# Altium schematic sheet LaunchPad Connectors.SchDoc
size A2
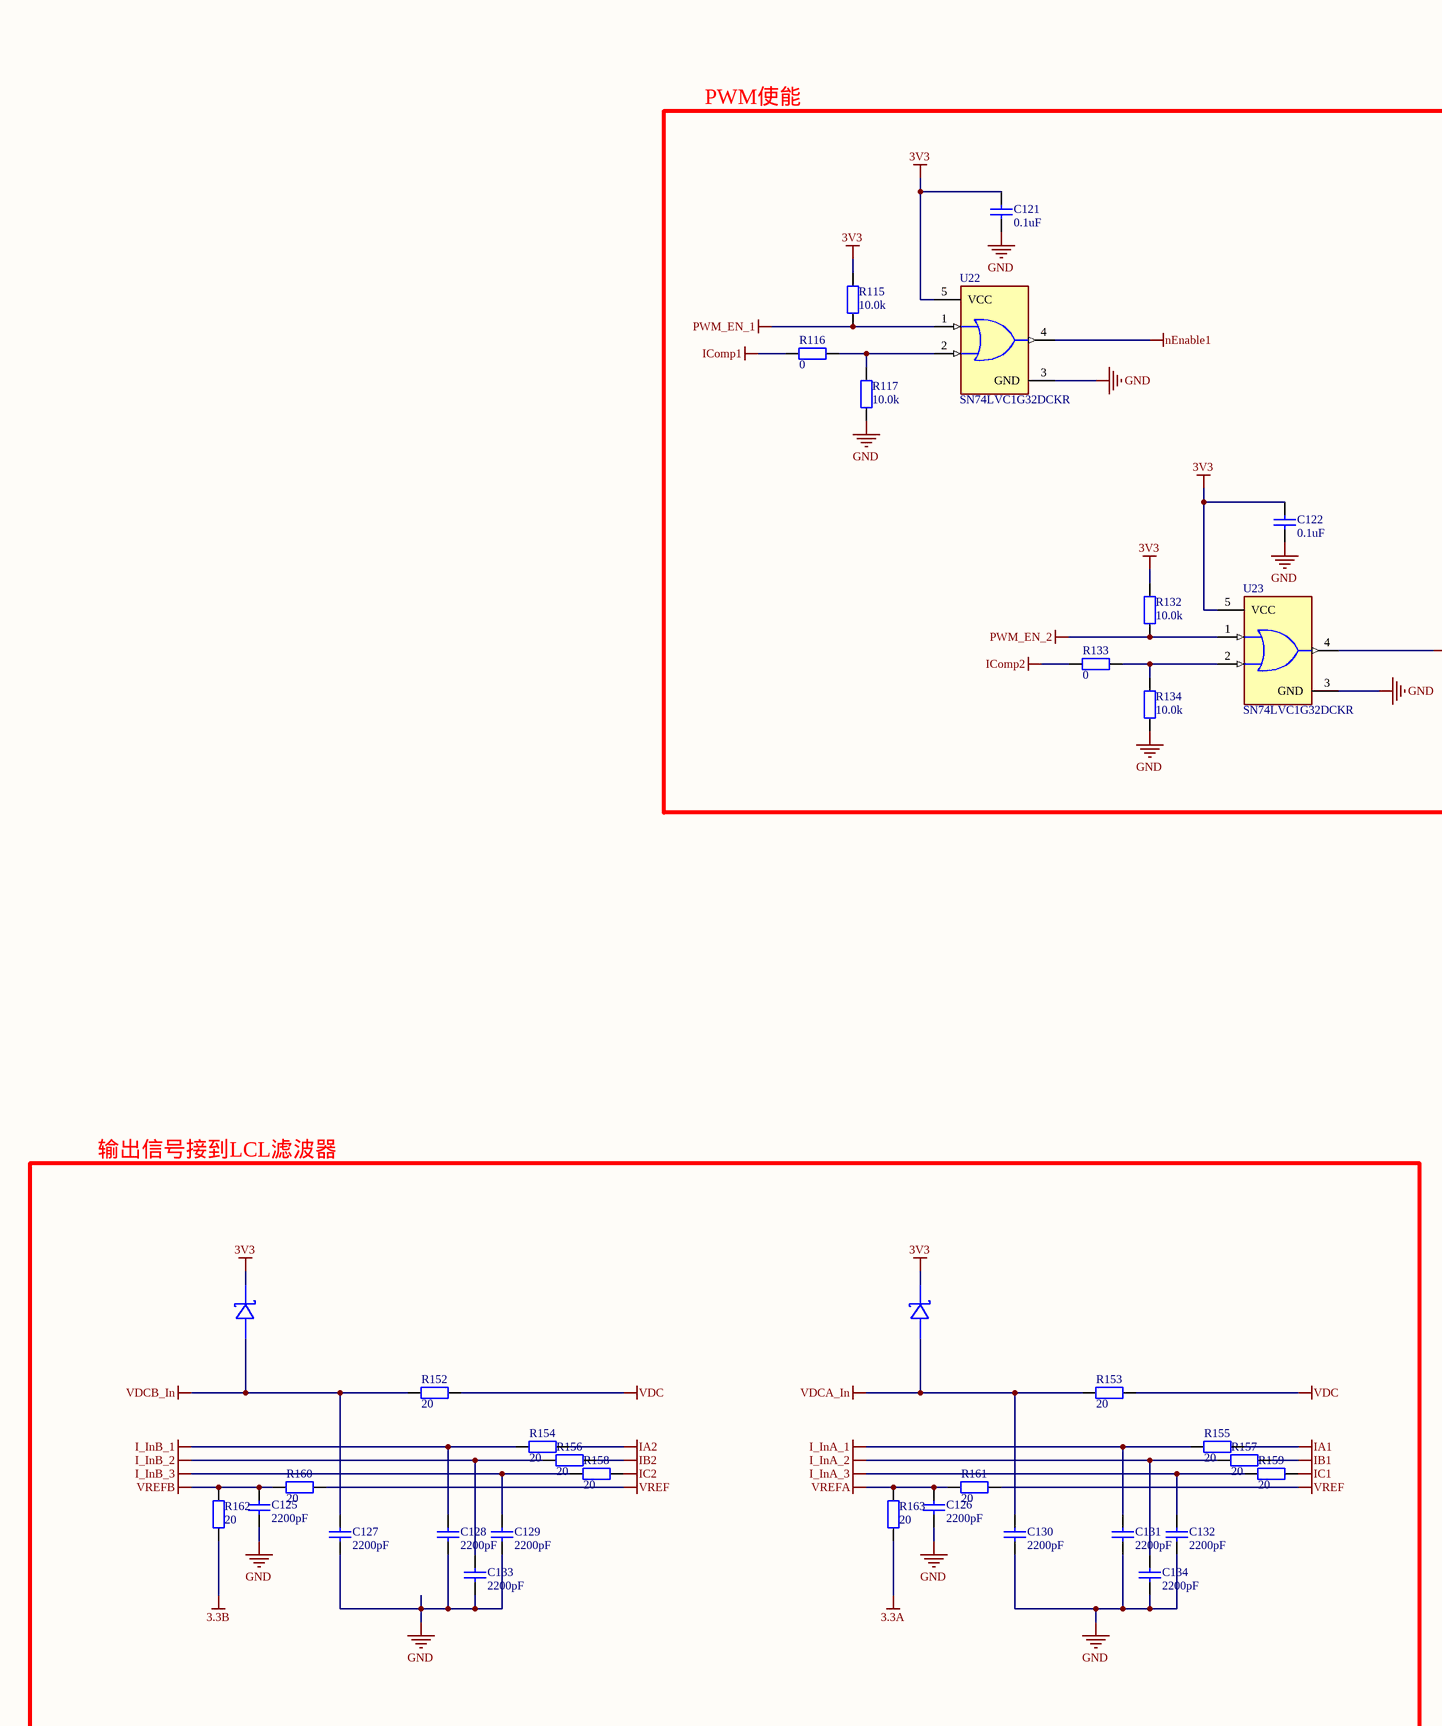
[diagram p0: LaunchPad Connectors.SchDoc, left]
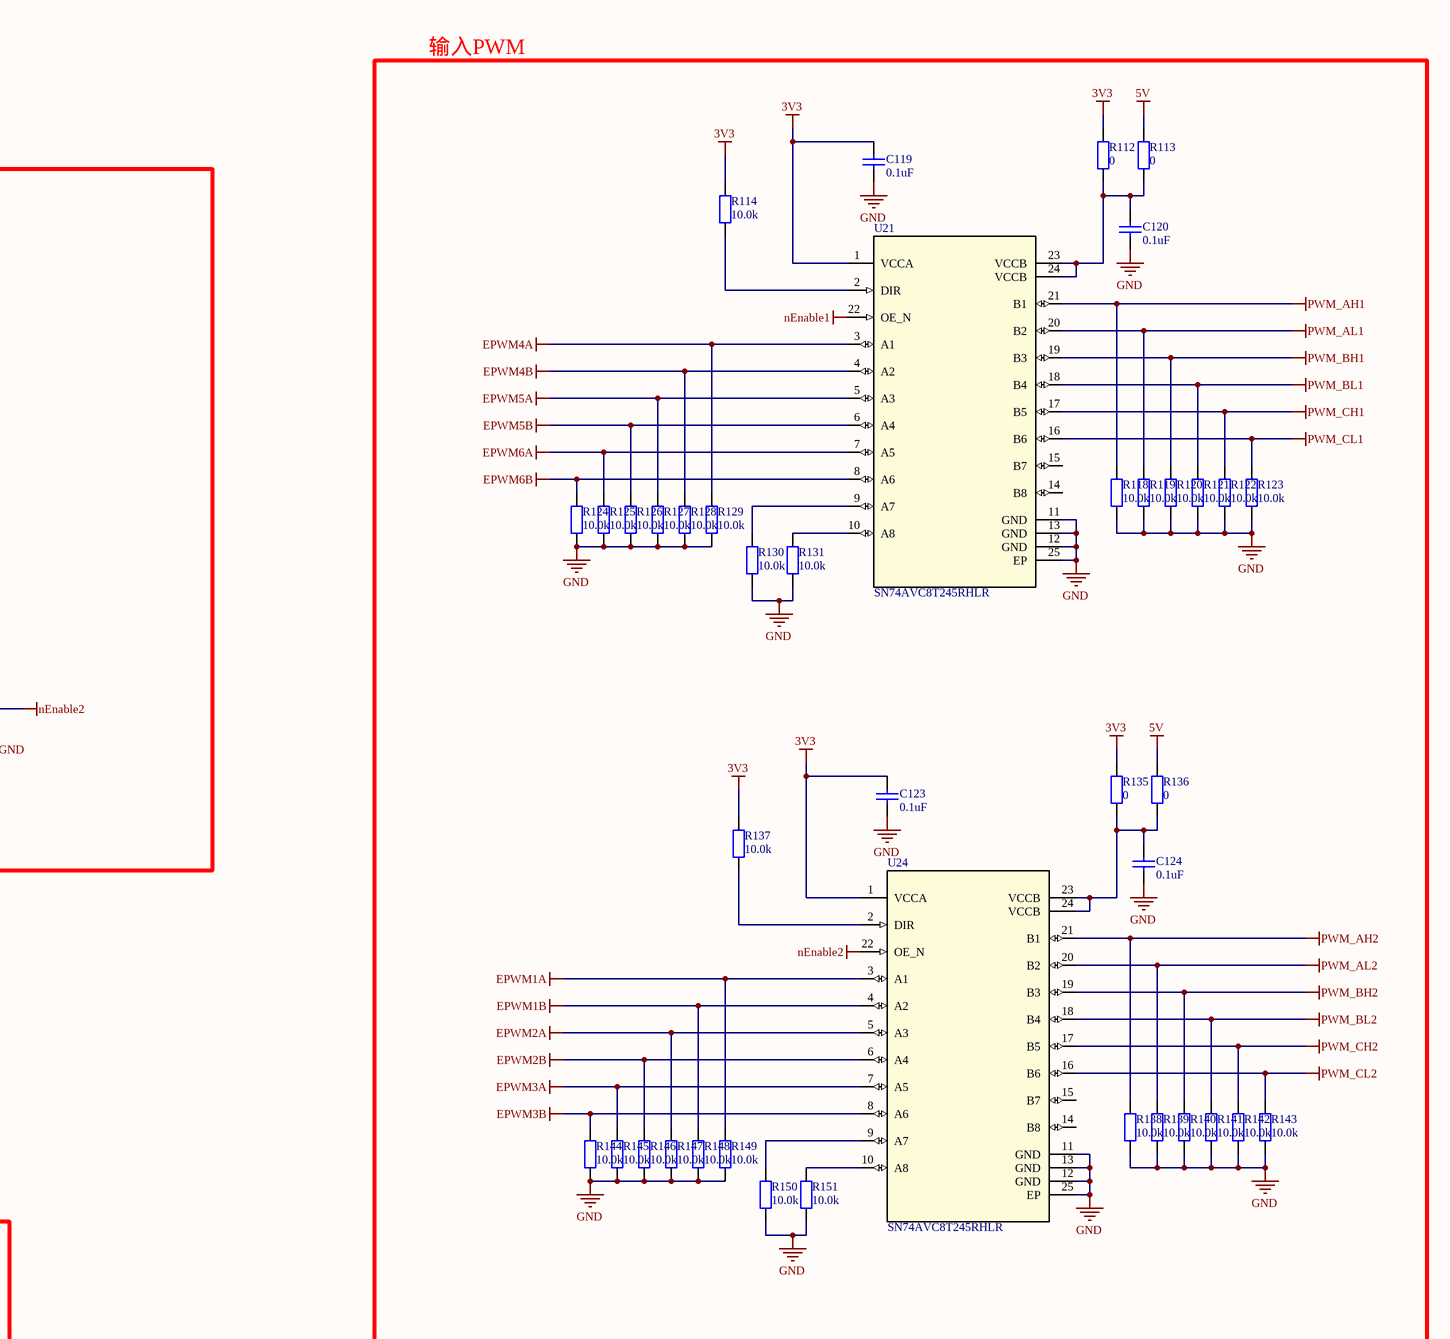
[diagram p1: LaunchPad Connectors.SchDoc, right]

## Parts
C119  0.1uF  [CAPC1608X06N]
C120  0.1uF  [CAPC1608X06N]
C121  0.1uF  [CAPC1608X06N]
C122  0.1uF  [CAPC1608X06N]
C123  0.1uF  [CAPC1608X06N]
C124  0.1uF  [CAPC1608X06N]
C125  2200pF  [CAPC1608X06N]
C126  2200pF  [CAPC1608X06N]
C127  2200pF  [CAPC1608X06N]
C128  2200pF  [CAPC1608X06N]
C129  2200pF  [CAPC1608X06N]
C130  2200pF  [CAPC1608X06N]
C131  2200pF  [CAPC1608X06N]
C132  2200pF  [CAPC1608X06N]
C133  2200pF  [CAPC1608X06N]
C134  2200pF  [CAPC1608X06N]
D1  1PS79SB70,115  [SOD-523_L1.2-W0.8-LS1.6-RD]  (value not drawn)
D2  1PS79SB70,115  [SOD-523_L1.2-W0.8-LS1.6-RD]  (value not drawn)
R112  0  [RESC1608X05N]
R113  0  [RESC1608X05N]
R114  10.0k  [RESC1608X05N]
R115  10.0k  [RESC1608X05N]
R116  0  [RESC1608X05N]
R117  10.0k  [RESC1608X05N]
R118  10.0k  [RESC1608X05N]
R119  10.0k  [RESC1608X05N]
R120  10.0k  [RESC1608X05N]
R121  10.0k  [RESC1608X05N]
R122  10.0k  [RESC1608X05N]
R123  10.0k  [RESC1608X05N]
R124  10.0k  [RESC1608X05N]
R125  10.0k  [RESC1608X05N]
R126  10.0k  [RESC1608X05N]
R127  10.0k  [RESC1608X05N]
R128  10.0k  [RESC1608X05N]
R129  10.0k  [RESC1608X05N]
R130  10.0k  [RESC1608X05N]
R131  10.0k  [RESC1608X05N]
R132  10.0k  [RESC1608X05N]
R133  0  [RESC1608X05N]
R134  10.0k  [RESC1608X05N]
R135  0  [RESC1608X05N]
R136  0  [RESC1608X05N]
R137  10.0k  [RESC1608X05N]
R138  10.0k  [RESC1608X05N]
R139  10.0k  [RESC1608X05N]
R140  10.0k  [RESC1608X05N]
R141  10.0k  [RESC1608X05N]
R142  10.0k  [RESC1608X05N]
R143  10.0k  [RESC1608X05N]
R144  10.0k  [RESC1608X05N]
R145  10.0k  [RESC1608X05N]
R146  10.0k  [RESC1608X05N]
R147  10.0k  [RESC1608X05N]
R148  10.0k  [RESC1608X05N]
R149  10.0k  [RESC1608X05N]
R150  10.0k  [RESC1608X05N]
R151  10.0k  [RESC1608X05N]
R152  20  [RESC1608X05N]
R153  20  [RESC1608X05N]
R154  20  [RESC1608X05N]
R155  20  [RESC1608X05N]
R156  20  [RESC1608X05N]
R157  20  [RESC1608X05N]
R158  20  [RESC1608X05N]
R159  20  [RESC1608X05N]
R160  20  [RESC1608X05N]
R161  20  [RESC1608X05N]
R162  20  [RESC1608X05N]
R163  20  [RESC1608X05N]
U21  SN74AVC8T245RHLR  [RHL0024A]
U22  SN74LVC1G32DCKR  [FP-DCK0005A-IPC_A]
U23  SN74LVC1G32DCKR  [FP-DCK0005A-IPC_A]
U24  SN74AVC8T245RHLR  [RHL0024A]

## Nets
3.3A: R163.2
3.3B: R162.2
3V3: C119.1 C121.1 C122.1 C123.1 D1.1(K) D2.1(K) R112.2 R114.1 R115.1 R132.1 R135.2 R137.1 U21.1(VCCA) U22.5(VCC) U23.5(VCC) U24.1(VCCA)
5V: R113.2 R136.2
EPWM1A: R149.2 U24.3(A1)
EPWM1B: R148.2 U24.4(A2)
EPWM2A: R147.1 U24.5(A3)
EPWM2B: R146.2 U24.6(A4)
EPWM3A: R145.2 U24.7(A5)
EPWM3B: R144.2 U24.8(A6)
EPWM4A: R129.2 U21.3(A1)
EPWM4B: R128.2 U21.4(A2)
EPWM5A: R127.1 U21.5(A3)
EPWM5B: R126.2 U21.6(A4)
EPWM6A: R125.2 U21.7(A5)
EPWM6B: R124.2 U21.8(A6)
GND: C119.2 C120.2 C121.2 C122.2 C123.2 C124.2 C125.2 C126.2 C127.2 C128.2 C129.2 C130.2 C131.2 C132.2 C133.2 C134.2 R117.1 R118.2 R119.2 R120.2 R121.2 R122.2 R123.2 R124.1 R125.1 R126.1 R127.2 R128.1 R129.1 R130.2 R131.2 R134.1 R138.2 R139.2 R140.2 R141.2 R142.2 R143.2 R144.1 R145.1 R146.1 R147.2 R148.1 R149.1 R150.2 R151.2 U21.11(GND) U21.12(GND) U21.13(GND) U21.25(EP) U22.3(GND) U23.3(GND) U24.11(GND) U24.12(GND) U24.13(GND) U24.25(EP)
I_InA_1: C131.1 R155.2
I_InA_2: C134.1 R157.2
I_InA_3: C132.1 R159.2
I_InB_1: C128.1 R154.2
I_InB_2: C133.1 R156.2
I_InB_3: C129.1 R158.2
IA1: R155.1
IA2: R154.1
IB1: R157.1
IB2: R156.1
IC1: R159.1
IC2: R158.1
IComp1: R116.1
IComp2: R133.1
nEnable1: U21.22(OE_N) U22.4(Y)
nEnable2: U23.4(Y) U24.22(OE_N)
PWM_AH1: R118.1 U21.21(B1)
PWM_AH2: R138.1 U24.21(B1)
PWM_AL1: R119.1 U21.20(B2)
PWM_AL2: R139.1 U24.20(B2)
PWM_BH1: R120.1 U21.19(B3)
PWM_BH2: R140.1 U24.19(B3)
PWM_BL1: R121.1 U21.18(B4)
PWM_BL2: R141.1 U24.18(B4)
PWM_CH1: R122.1 U21.17(B5)
PWM_CH2: R142.1 U24.17(B5)
PWM_CL1: R123.1 U21.16(B6)
PWM_CL2: R143.1 U24.16(B6)
PWM_EN_1: R115.2 U22.1(A)
PWM_EN_2: R132.2 U23.1(A)
VDC: R152.1 R153.1
VDCA_In: C130.1 D2.2(A) R153.2
VDCB_In: C127.1 D1.2(A) R152.2
VREF: R160.1 R161.1
VREFA: C126.1 R161.2 R163.1
VREFB: C125.1 R160.2 R162.1
NetC120_1: C120.1 R112.1 R113.1 U21.23(VCCB) U21.24(VCCB)
NetC124_1: C124.1 R135.1 R136.1 U24.23(VCCB) U24.24(VCCB)
NetR114_2: R114.2 U21.2(DIR)
NetR116_2: R116.2 R117.2 U22.2(B)
NetR130_1: R130.1 U21.9(A7)
NetR131_1: R131.1 U21.10(A8)
NetR133_2: R133.2 R134.2 U23.2(B)
NetR137_2: R137.2 U24.2(DIR)
NetR150_1: R150.1 U24.9(A7)
NetR151_1: R151.1 U24.10(A8)

Not connected (* = marked no-connect by the designer): U21 14(B8) 15(B7); U24 14(B8) 15(B7)

## Notes on the sheet
- 输入PWM
- PWM使能
- 输出信号接到LCL滤波器

## Library data of the parts
C119-C134 = Cap: Capacitor; Published: 8-Jun-2000; LatestRevisionDate: 17-Jul-2002; LatestRevisionNote: Re-released for DXP Platform.; PackageReference: RAD-0.3; Publisher: Altium Limited; PackageDescription: Radial Cap, Thru-Hole; 2 Leads; 0.3 in Pin Spacing
  C119-C124: Value: 0.1uF
  C125-C134: Value: 2200pF
D1 D2 = 1PS79SB70,115: Manufacturer: Nexperia(安世); Add into BOM: yes; Forward Voltage (Vf@If): 1V@15mA; Reverse Voltage (Vr): 70V; Average Rectified Current (Io): 70mA; Reverse Leakage Current (Ir): 10uA@70V; Symbol: 1PS79SB70,115; Device: 1PS79SB70,115; Supplier: LCSC; Manufacturer Part: 1PS79SB70,115; Supplier Part: C179321; JLCPCB Part Class: Extended Part; LCSC Part Name: 电压:70V 电流:70mA; Supplier Footprint: SOD-523; Datasheet: https://atta.szlcsc.com/upload/public/pdf/source/20180622/C194653_3DF408F362D9AF6B8137F44B9C19B985.pdf; Convert to PCB: yes
R112 R113 R135 R136 = Res: Resistor 0402; Value: K; Published: 8-Jun-2000; LatestRevisionDate: 17-Jul-2002; LatestRevisionNote: Re-released for DXP Platform.; PackageReference: AXIAL-0.4; Publisher: Altium Limited; PackageDescription: Axial Device, Thru-Hole; 2 Leads; 0.4 in Pin Spacing
R114-R134 R137-R163 = 0603 100KΩ (1003) 1%_4: 贴片电阻; Value: 1MΩ(1%); ComponentLink1Description: 供应商链接; ComponentLink1URL: http://www.szlcsc.com/product/details_26546.html; Package: 0603; Supplier: LC; SuppliersPartNumber: C25803
U21 U24 = SN74AVC8T245RHLR: No Description Available; Mfr_Name: Texas Instruments; CompType: IC; Type: DEV; RefDes: RefDes; Copyright: Copyright (C) 2024 Ultra Librarian. All rights reserved.; Manufacturer_Part_Number: SN74AVC8T245RHLR; PartNumber: SN74AVC8T245RHL; PackageReference: RHL0024A; MountType: SMT; RoHS: Y; Manufacturer: Texas Instruments
U22 U23 = CMP-0859-00376-4: IC GATE OR 1CH 2-INP SC70-5; Turn-On Delay Time: 4.5ns; Schmitt Trigger Input: No; Number of Bits: 1; High Level Output Current: -32mA; Max Supply Voltage: 5.5V; Propagation Delay: 4ns; Max Output Current: 32mA; Min Supply Voltage: 1.65V; Number of Input Lines: 2; Quiescent Current: 10uA; Case/Package: SC; Weight: 8.8E-05oz; Logic Function: OR; Package Quantity: 1; Packaging: Tape and Reel; Mount: Surface Mount; Max Operating Temperature: 125°C; Output Current: 32mA; Length: 2mm; Contact Plating: Gold; Number of Output Lines: 1; Height: 0.9mm; Number of Pins: 5; Width: 1.25mm; REACH SVHC: No SVHC; Number of Circuits: 1; Radiation Hardening: No; Number of Elements: 1; Low Level Output Current: 32mA; Number of Outputs: 1; Min Operating Temperature: -40°C; Number of Inputs: 2; Lead Free: Lead Free; Termination: SMD/SMT; Number of Gates: 1